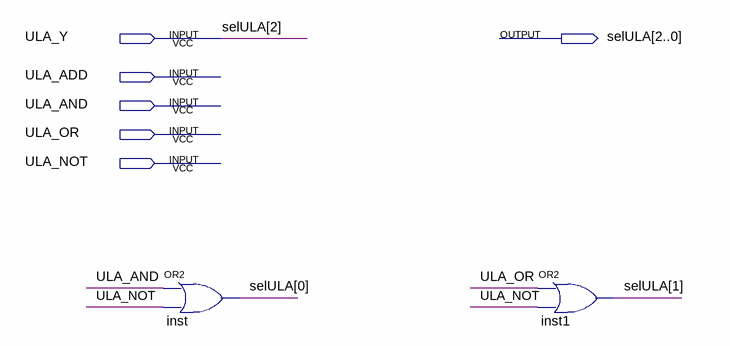
[diagram p0: schematic sheet]
// Quartus schematic Encoder_ULA.bdf as structural Verilog: 2 symbols, 6 pins
module Encoder_ULA (
  input  ULA_Y,
  input  ULA_ADD,
  input  ULA_AND,
  input  ULA_OR,
  input  ULA_NOT,
  output [2:0] selULA
);

  or inst (selULA[0], ULA_AND, ULA_NOT);
  or inst1 (selULA[1], ULA_OR, ULA_NOT);

  assign selULA[2] = ULA_Y;
endmodule
